# EAGLE design FT232RL (EAGLE 6.4)
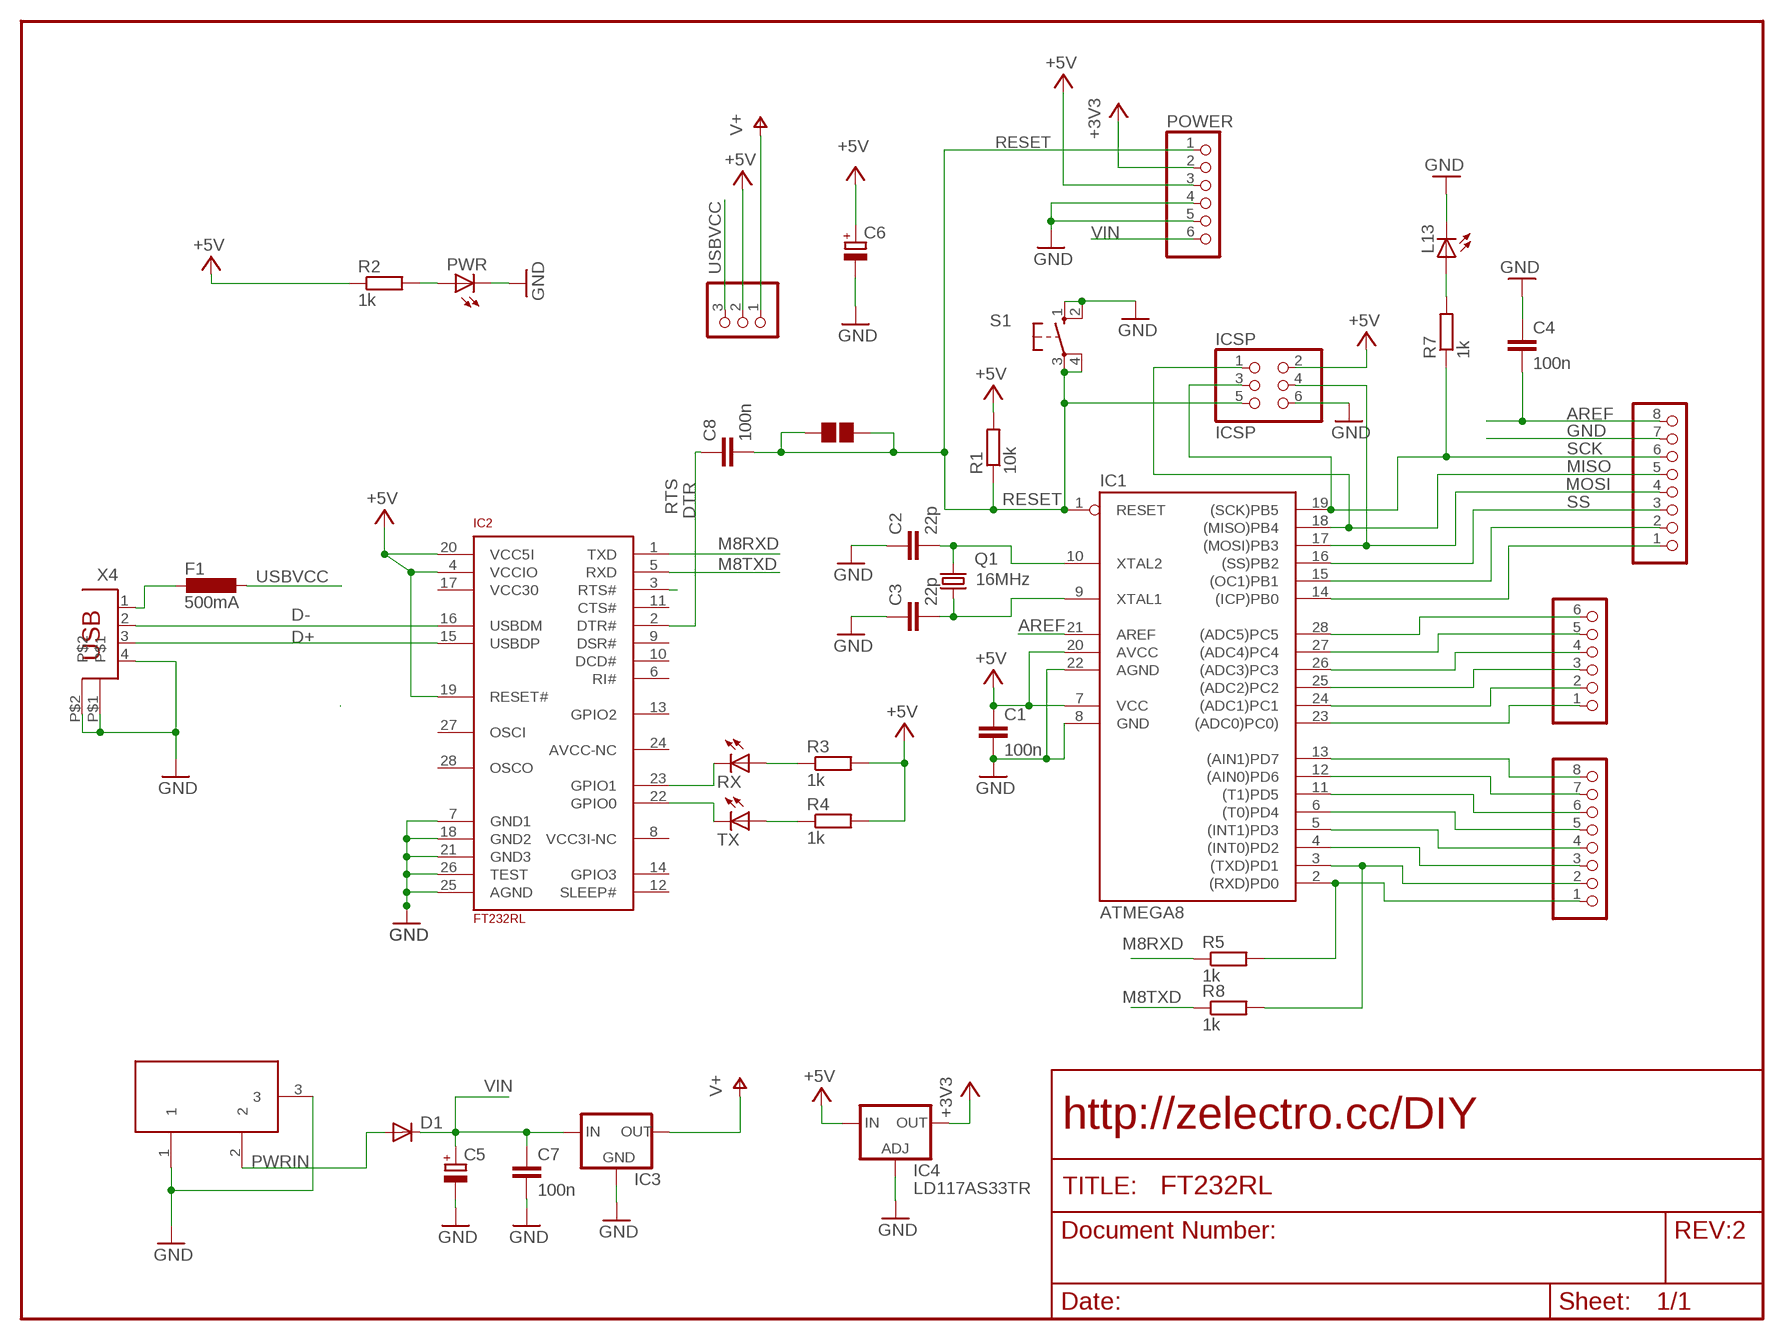
[diagram p0: schematic, sheet 1]

## Parts
C1  100n  C-EUC1206K  [C1206K]
C2  22p  C-EUC1206K  [C1206K]
C3  22p  C-EUC1206K  [C1206K]
C4  100n  C-EUC1206K  [C1206K]
C5  CPOL-EUE2.5-7  [E2,5-7]
C6  CPOL-EUE2.5-7  [E2,5-7]
C7  100n  C-EUC1206K  [C1206K]
C8  100n  C-EUC1206K  [C1206K]
D1  DIODE-SMB  [SMB]
F1  500mA  L-EUL1812  [L1812]
IC1  ATMEGA8  AT90S4433P  [DIL28-3]
IC2  FT232RL  [SSOP28]
IC3  78XXL  [78XXL]
IC4  LD117AS33TR  [SOT223]
ICSP  ICSP  PINHD-2X3  [2X03]
J1  PINHD-1X8  [1X08]
J2  PINHD-1X6  [1X06]
J3  PINHD-1X8  [1X08]
JP3  PINHD-1X3  [1X03]
L13  LED3MM  [LED3MM]
POWER  PINHD-1X6  [1X06]
PWR  LED3MM  [LED3MM]
Q1  16MHz  CRYTALHC49S  [HC49/S]
R1  10k  R-EU_M1406  [M1406]
R2  1k  R-EU_M1406  [M1406]
R3  1k  R-EU_M1406  [M1406]
R4  1k  R-EU_M1406  [M1406]
R5  1k  R-EU_M1406  [M1406]
R7  1k  R-EU_M1406  [M1406]
R8  1k  R-EU_M1406  [M1406]
RX  LED3MM  [LED3MM]
S1  10-XX  [B3F-10XX]
TX  LED3MM  [LED3MM]
X2  DC21MMX  [DC-21MM]
X4  PN61729  [PN61729]

## Nets
+3V3: IC4.4(OUT) POWER.2
+5V [usbvcc]: C1.1 C6.+ IC1.7(VCC) IC1.20(AVCC) IC2.4(VCCIO) IC2.19(RESET#) IC2.20(VCC5I) IC4.3(IN) ICSP.2 JP3.2 POWER.3 R1.2 R2.1 R3.2 R4.2
AREF [aref]: C4.2 IC1.21(AREF) J3.8
D+: IC2.15(USBDP) X4.3
D-: IC2.16(USBDM) X4.2
DTR: C8.1 IC2.2(DTR#)
GND [gnd]: C1.2 C2.1 C3.1 C4.1 C5.- C6.- C7.2 IC1.8(GND) IC1.22(AGND) IC2.7(GND1) IC2.18(GND2) IC2.21(GND3) IC2.25(AGND) IC2.26(TEST) IC3.GND IC4.1(ADJ) ICSP.6 J3.7 L13.K(C) POWER.4 POWER.5 PWR.K(C) S1.1(S) S1.2(S1) X2.1 X2.3 X4.4 X4.P$1 X4.P$2
M8RXD: IC2.1(TXD) R5.1
M8TXD: IC2.5(RXD) R8.1
MISO: IC1.18((MISO)PB4) ICSP.1 J3.5
MOSI: IC1.17((MOSI)PB3) ICSP.4 J3.4
N$2: L13.A R7.2
N$3: PWR.A R2.2
N$5: IC1.14((ICP)PB0) J3.1
N$6: C3.2 IC1.9(XTAL1) Q1.1
N$7: C2.2 IC1.10(XTAL2) Q1.2
N$8 [usbvcc]: F1.2 X4.1
N$10: IC1.4((INT0)PD2) J1.3
N$11: IC1.5((INT1)PD3) J1.4
N$12: IC1.6((T0)PD4) J1.5
N$13: IC1.11((T1)PD5) J1.6
N$14: IC1.12((AIN0)PD6) J1.7
N$15: IC1.13((AIN1)PD7) J1.8
N$16: IC1.23((ADC0)PC0)) J2.1
N$17: IC1.24((ADC1)PC1) J2.2
N$18: IC1.25((ADC2)PC2) J2.3
N$19: IC1.26((ADC3)PC3) J2.4
N$20: IC1.27((ADC4)PC4) J2.5
N$21: IC1.28((ADC5)PC5) J2.6
N$22: IC1.15((OC1)PB1) J3.2
N$32: IC2.23(GPIO1) RX.K(C)
N$34: IC2.22(GPIO0) TX.K(C)
N$35: R3.1 RX.A
N$36: R4.1 TX.A
PD0: IC1.2((RXD)PD0) J1.1 R5.2
PD1: IC1.3((TXD)PD1) J1.2 R8.2
PWRIN [power]: D1.A X2.2
RESET: C8.2 IC1.1(RESET) ICSP.5 POWER.1 R1.1 S1.3(P) S1.4(P1)
RTS: IC2.3(RTS#)
SCK: IC1.19((SCK)PB5) ICSP.3 J3.6 R7.1
SS: IC1.16((SS)PB2) J3.3
USBVCC [usbvcc]: F1.1 JP3.3
V+ [usbvcc]: IC3.OUT JP3.1
VIN [power]: C5.+ C7.1 D1.C IC3.IN POWER.6
Unconnected: IC2.6(RI#) IC2.8(VCC3I-NC) IC2.9(DSR#) IC2.10(DCD#) IC2.11(CTS#) IC2.12(SLEEP#) IC2.13(GPIO2) IC2.14(GPIO3) IC2.24(AVCC-NC) IC2.27(OSCI) IC2.28(OSCO)

## Notes on the sheet
- http://zelectro.cc/DIY
- 2

## Power pins joined to a net without a drawn wire
VCC30: IC2.17(VCC30)

## Library data of the parts
C1-C4 C7 C8 = rcl:C-EU: CAPACITOR, European symbol
C5 C6 = rcl:CPOL-EU: POLARIZED CAPACITOR, European symbol
D1 = diode:DIODE-: DIODE
F1 = rcl:L-EU: INDUCTOR, European symbol
IC1 = atmel:AT90S4433: MICROCONTROLLER 4 Kbytes FLASH 128 bytes SRAM 256 bytes EEPROM UART 6-channel 10 bit ADC
IC2 = SmartPrj:FT232RL
IC3 = v-reg:78XXL: VOLTAGE REGULATOR
IC4 = v-reg:LD117A?*: Low drop fixed and adjustable positive voltage regulators 1 A Source: http://www.st.com/stonline/products/literature/ds/7194/ld1117axx.pdf
ICSP = pinhead:PINHD-2X3: PIN HEADER
J1 J3 = pinhead:PINHD-1X8: PIN HEADER
J2 POWER = pinhead:PINHD-1X6: PIN HEADER
JP3 = pinhead:PINHD-1X3: PIN HEADER
L13 PWR RX TX = led:LED: LED OSRAM: - CHIPLED LG R971, LG N971, LY N971, LG Q971, LY Q971, LO R971, LY R971 LH N974, LH R974 LS Q976, LO Q976, LY Q976 LO Q996 - Hyper CHIPLED LW Q18S LB Q993, LB Q99A, LB R99A - SideLED LS A670, LO A670, LY A670, LG A670, LP A670 LB A673, LV A673, LT A673, LW A673 LH A674 LY A675 LS A676, LA A676, LO A676, LY A676, LW A676 LS A679, LY A679, LG A679 - Hyper Micro SIDELED® LS Y876, LA Y876, LO Y876, LY Y876 LT Y87S - SmartLED LW L88C, LW L88S LB L89C, LB L89S, LG L890 LS L89K, LO L89K, LY L89K LS L896, LA L896, LO L896, LY L896 - TOPLED LS T670, LO T670, LY T670, LG T670, LP T670 LSG T670, LSP T670, LSY T670, LOP T670, LYG T670 LG T671, LOG T671, LSG T671 LB T673, LV T673, LT T673, LW T673 LH T674 LS T676, LA T676, LO T676, LY T676, LB T676, LH T676, LSB T676, LW T676 LB T67C, LV T67C, LT T67C, LS T67K, LO T67K, LY T67K, LW E67C LS E67B, LA E67B, LO E67B, LY E67B, LB E67C, LV E67C, LT E67C LW T67C LS T679, LY T679, LG T679 LS T770, LO T770, LY T770, LG T770, LP T770 LB T773, LV T773, LT T773, LW T773 LH T774 LS E675, LA E675, LY E675, LS T675 LS T776, LA T776, LO T776, LY T776, LB T776 LHGB T686 LT T68C, LB T68C - Hyper Mini TOPLED® LB M676 - Mini TOPLED Santana® LG M470 LS M47K, LO M47K, LY M47K Source: http://www.osram.convergy.de LUXEON: - LUMILED® LXK2-PW12-R00, LXK2-PW12-S00, LXK2-PW14-U00, LXK2-PW14-V00 LXK2-PM12-R00, LXK2-PM12-S00, LXK2-PM14-U00 LXK2-PE12-Q00, LXK2-PE12-R00, LXK2-PE12-S00, LXK2-PE14-T00, LXK2-PE14-U00 LXK2-PB12-K00, LXK2-PB12-L00, LXK2-PB12-M00, LXK2-PB14-N00, LXK2-PB14-P00, LXK2-PB14-Q00 LXK2-PR12-L00, LXK2-PR12-M00, LXK2-PR14-Q00, LXK2-PR14-R00 LXK2-PD12-Q00, LXK2-PD12-R00, LXK2-PD12-S00 LXK2-PH12-R00, LXK2-PH12-S00 LXK2-PL12-P00, LXK2-PL12-Q00, LXK2-PL12-R00 Source: www.luxeon.com KINGBRIGHT: KA-3528ASYC Source: www.kingbright.com
Q1 = crystal:CRYTAL: CRYSTAL
R1-R5 R7 R8 = rcl:R-EU_: RESISTOR, European symbol
S1 = switch-omron:10-XX: OMRON SWITCH
X2 = powersupply:DC21MM
X4 = SmartPrj:PN61729: BERG USB connector

## Net classes
1 power: width 0.61 mm, drill 0.508 mm, clearance 0.152 mm
2 gnd: width 0.305 mm, drill 0.508 mm, clearance 0.152 mm
3 usbvcc: width 0.508 mm, drill 0.508 mm, clearance 0.152 mm
4 aref: width 0.406 mm

## Board
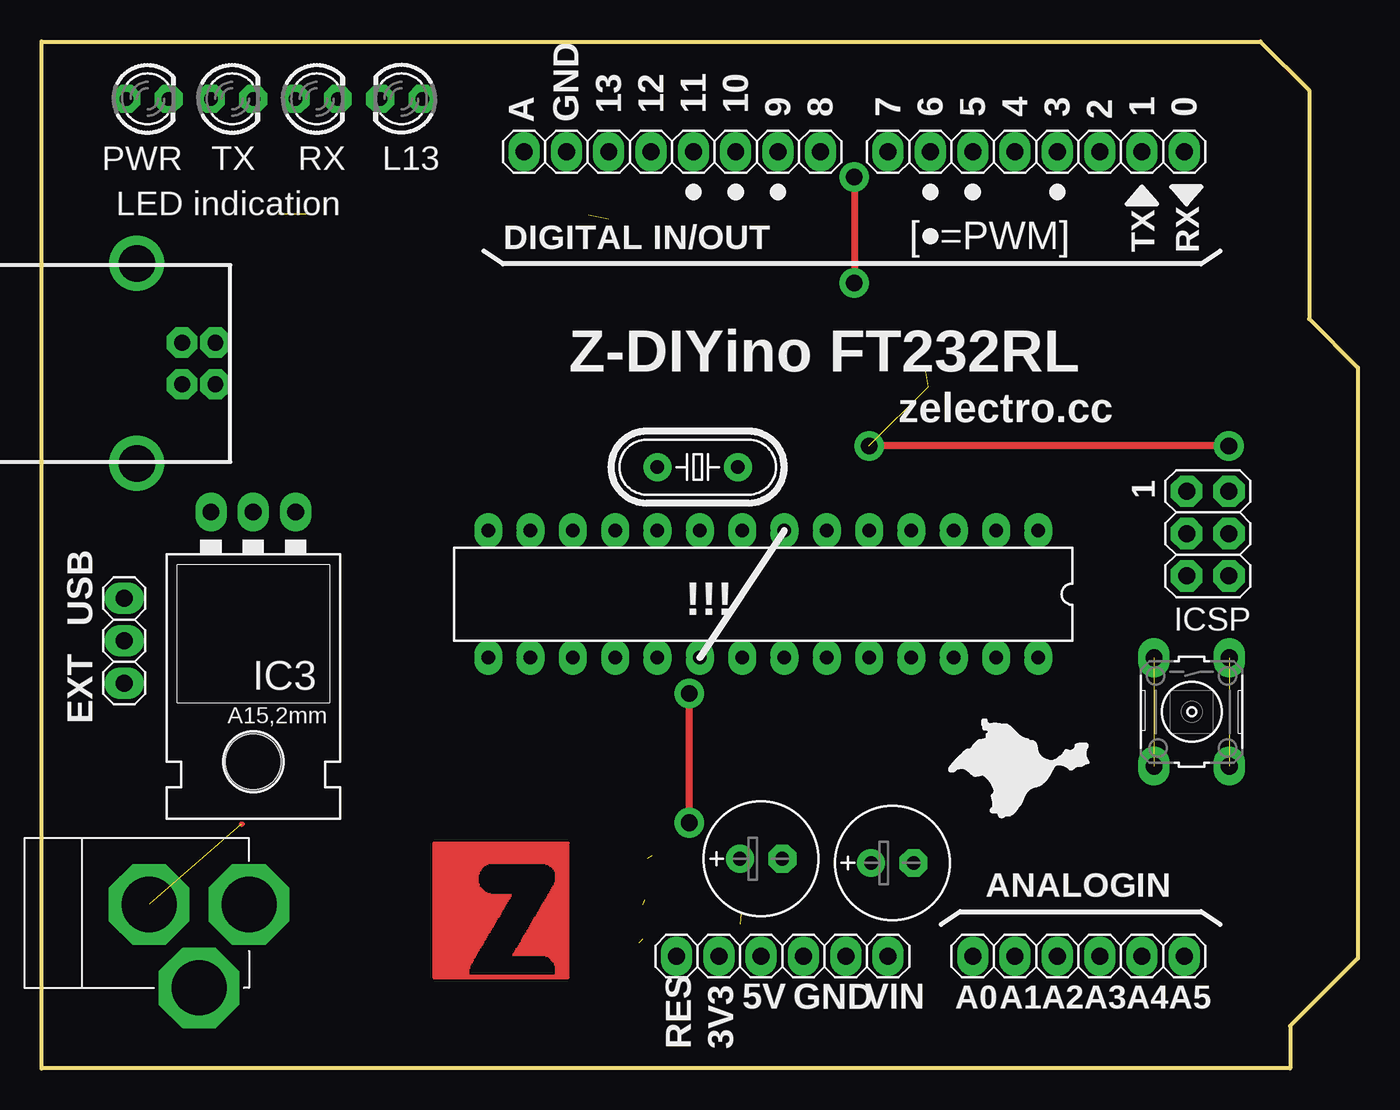
[diagram p1: board, top side]
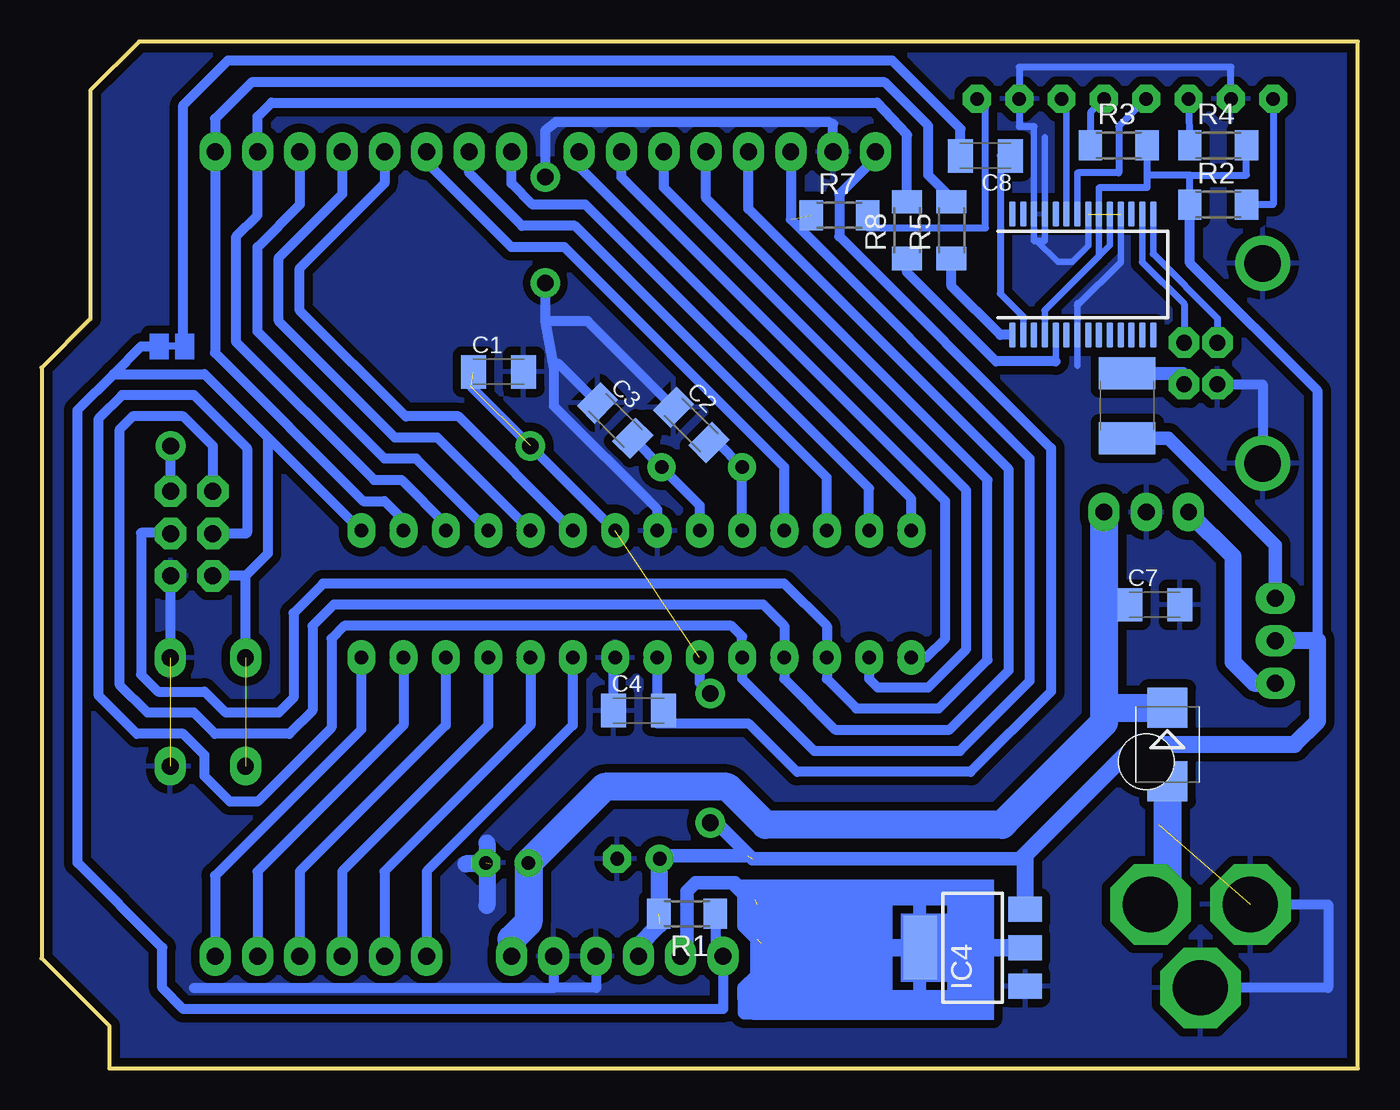
[diagram p2: board, bottom side, seen from below]

Size 78.99 x 61.59 mm. Coordinates in mm from the lower left corner, seen from the top.
Outline: 0,61.59 73.15,61.59 76.07,58.67 76.07,44.96 78.99,42.04 78.99,6.6 74.93,2.54 74.93,0 0,0 0,61.59
Copper layers (1*16): Top 0.035mm / dielectric 1.5mm / Bottom 0.035mm
Design rules "default": minimum track width 10mil, minimum drill 24mil, track to track 8mil, track to pad 8mil, pad to pad 8mil, via to via 8mil, smd to smd 8mil, copper to edge 20mil, drill to drill 8mil, minimum pad ring 17mil, minimum via ring 8mil, stop-mask expansion 0mil, vias tented up to drill 0mil, thermal gap 20mil

### Footprints (pad centres in the part's own frame; a part is rotated, then mirrored left to right if it is on the bottom)
C1206K = smd 1.5 x 2: 1 -1.5,0; 2 1.5,0
E2,5-7 = drill 0.813 pad 1.6: + -1.27,0 | drill 0.813 pad 1.6 octagon: - 1.27,0
SMB = smd 2.4 x 2.4: A 2.2,0; C -2.2,0
L1812 = smd 1.9 x 3.4: 1 -1.95,0; 2 1.95,0
DIL28-3 = drill 0.813 long: 1 -16.51,-3.81; 2 -13.97,-3.81; 3 -11.43,-3.81; 4 -8.89,-3.81; 5 -6.35,-3.81; 6 -3.81,-3.81; 7 -1.27,-3.81; 8 1.27,-3.81; 9 3.81,-3.81; 10 6.35,-3.81; 11 8.89,-3.81; 12 11.43,-3.81; 13 13.97,-3.81; 14 16.51,-3.81; 15 16.51,3.81; 16 13.97,3.81; 17 11.43,3.81; 18 8.89,3.81; 19 6.35,3.81; 20 3.81,3.81; 21 1.27,3.81; 22 -1.27,3.81; 23 -3.81,3.81; 24 -6.35,3.81; 25 -8.89,3.81; 26 -11.43,3.81; 27 -13.97,3.81; 28 -16.51,3.81
SSOP28 = smd 0.381 x 1.499: 1 -4.225,-3.625; 2 -3.575,-3.625; 3 -2.925,-3.625; 4 -2.275,-3.625; 5 -1.625,-3.625; 6 -0.975,-3.625; 7 -0.325,-3.625; 8 0.325,-3.625; 9 0.975,-3.625; 10 1.625,-3.625; 11 2.275,-3.625; 12 2.925,-3.625; 13 3.575,-3.625; 14 4.225,-3.625; 15 4.225,3.625; 16 3.575,3.625; 17 2.925,3.625; 18 2.275,3.625; 19 1.625,3.625; 20 0.975,3.625; 21 0.325,3.625; 22 -0.325,3.625; 23 -0.975,3.625; 24 -1.625,3.625; 25 -2.275,3.625; 26 -2.925,3.625; 27 -3.575,3.625; 28 -4.225,3.625
78XXL = drill 1.016 long: GND 0,-3.81; IN -2.54,-3.81; OUT 2.54,-3.81 | hole 3.302: 0,11.176
SOT223 = smd 1.5 x 2: 1 -2.3,-3.15; 2 0,-3.15; 3 2.3,-3.15 | smd 3.8 x 2: 4 0,3.15
2X03 = drill 1.016 octagon: 1 -2.54,-1.27; 2 -2.54,1.27; 3 0,-1.27; 4 0,1.27; 5 2.54,-1.27; 6 2.54,1.27
1X08 = drill 1.016 long: 1 -8.89,0; 2 -6.35,0; 3 -3.81,0; 4 -1.27,0; 5 1.27,0; 6 3.81,0; 7 6.35,0; 8 8.89,0
1X06 = drill 1.016 long: 1 -6.35,0; 2 -3.81,0; 3 -1.27,0; 4 1.27,0; 5 3.81,0; 6 6.35,0
1X03 = drill 1.016 long: 1 -2.54,0; 2 0,0; 3 2.54,0
LED3MM = drill 0.813 octagon: A -1.27,0; K 1.27,0
HC49/S = drill 0.813: 1 -2.413,0; 2 2.413,0
M1406 = smd 1.4 x 1.8: 1 -1.7,0; 2 1.7,0
B3F-10XX = drill 1.016 long: 1 -3.251,2.261; 2 3.251,2.261; 3 -3.251,-2.261; 4 3.251,-2.261
DC-21MM = drill 3.302 pad 4.826 octagon: 1 -5.08,-3.353; 2 -0.076,-6.35; 3 -0.076,-0.356
PN61729 = drill 0.95 octagon: 1 1.25,4.71; 2 -1.25,4.71; 3 -1.25,2.71; 4 1.25,2.71 | drill 2.2: P$1 -6,0; P$2 6,0

### Placement (x,y rotation side)
C1  51.56,41.78 0 bottom
C2  40,38.61 315 bottom
C3  44.58,38.86 315 bottom
C4  43.18,21.46 0 bottom
C5  51.05,12.32 0 top
C6  43.18,12.57 0 top
C7  12.19,27.81 0 bottom
C8  22.35,54.74 180 bottom
D1  11.43,19.43 270 bottom
F1  13.84,39.75 90 bottom
IC1  43.31,28.45 180 top
IC2  16.51,47.62 0 bottom
IC3  12.7,29.57 180 top
IC4  23.11,7.24 90 bottom
ICSP  69.99,32.08 270 top
J1  59.69,54.99 180 top
J2  62.23,6.73 0 top
J3  37.85,54.99 180 top
JP3  4.95,25.65 90 top
L13  21.59,58.17 180 top
POWER  44.45,6.73 0 top
PWR  6.35,58.17 0 top
Q1  39.37,36.07 180 top
R1  40.26,9.27 180 bottom
R2  8.38,51.82 0 bottom
R3  14.35,55.37 0 bottom
R4  8.38,55.37 0 bottom
R5  24.38,50.29 90 bottom
R7  31.11,51.18 0 bottom
R8  27.05,50.29 90 bottom
RX  16.51,58.17 0 top
S1  69.02,21.39 270 top
TX  11.43,58.17 0 top
X2  6.1,9.91 90 top
X4  5.71,42.29 270 top

### Tracks (layer width: path | path; a pad name or v marks a point on that pad's centre or on a via)
+3V3  (2 unrouted)
  Bottom 0.61: POWER.2 40.26,7.11 | 36.2,10.11 32.13,7.11 IC4.4 19.66,7.24
  Bottom 0.813: 40.26,7.11 40.26,10.62 39.75,11.12 37.39,11.12 | 37.54,11.12 37.46,11.05 | 37.46,11.05 36.83,10.41 36.83,8.51 36.07,7.75 36.07,5.59 36.83,4.83 36.8,3.33 36.17,3.33 36.2,4.83 | 35.81,7.49 35.81,8.38 36.45,9.02 36.45,10.67 | 37.46,11.05 37.39,11.12 | 37.39,11.12 36.07,9.8 36.07,8.76
+5V  (via drill 1 pad 1.78)  (5 unrouted)
  Top 0.406: v38.86,22.48 v38.86,14.73 | v71.25,37.34 v49.66,37.34
  Bottom 0.381: IC2.19 14.88,49.38 15.54,48.73 IC2.20 15.54,52.83 15.49,52.83 | 18.79,45.48 IC2.4
  Bottom 0.406: R3.2 12.65,53.59 | 10.08,53.59 6.68,53.59 R4.2 | 12.65,53.59 12.65,52.83 15.49,52.83 | 15.54,48.73 18.79,45.48 | R2.1 10.08,53.59 | 10.08,53.59 12.65,53.59
  Bottom 0.61: ICSP.2 71.26,37.08 v71.25,37.34 | 19.96,12.57 20.19,12.57 | 2.41,25.65 2.41,40.64 10.08,48.31 R2.1 | IC1.20 39.5,23.11 v38.86,22.48 | POWER.3 43.18,7.37 | 53.21,40.89 IC1.7
  Bottom 0.813: 20.19,12.57 36.32,12.57 38.48,14.73 v38.86,14.73 | C6.+ 41.72,12.76 36.64,12.76
  Bottom 1.016: IC4.3 19.96,12.57 | 20.19,12.57 13.34,19.43 3.81,19.43 2.41,20.83 2.41,25.65 JP3.2 | 43.18,7.37 41.91,8.64 C6.+
AREF
  Bottom 0.61: J3.8 28.96,54.61 31.11,52.45 31.11,49.91 18.41,37.21 18.41,22.61 23.24,17.78 33.66,17.78 36.58,20.7 42.04,20.7 42.04,21.72 | C4.2 42.04,21.72 | 42.04,21.72 IC1.21
D+
  Bottom 0.381: IC2.15 12.29,48.86
  Bottom 0.406: 12.29,48.86 8.43,45 X4.3
D-
  Bottom 0.381: IC2.16 12.94,48.37
  Bottom 0.406: 12.94,48.37 10.43,45.86 X4.2
DTR
  Bottom 0.381: 20.08,45.1 IC2.2
  Bottom 0.406: C8.1 21.46,54.76 21.46,46.48 20.08,45.1
GND  (via drill 1 pad 1.78)  (4 unrouted)
  Top 0.305: 11.99,14.66 12.04,14.66
  Top 0.406: v48.77,53.47 v48.77,47.12
  Bottom 0.381: IC2.21 16.18,49.35 17.14,48.39 18.01,48.39 19.28,49.66 | 18.79,49.66 IC2.25 | 19.43,49.66 IC2.26 19.43,56.51 | IC2.18 14.24,48.38 | 16.84,45.78 IC2.7 | 16.83,45.9 16.83,42.16 | 18.79,55.85 18.79,50.59
  Bottom 0.406: 19.43,49.66 19.28,49.66 18.79,49.66 | 19.43,56.51 20.32,56.51 L13.K 20.32,60.07 7.62,60.07 PWR.K | 14.24,48.38 16.84,45.78
  Bottom 0.61: S1.1 71.26,25.25 ICSP.6 | J3.7 31.5,56.64 31.75,56.77 48.13,56.77 48.77,56.26 v48.77,53.47 | v48.77,47.12 48.77,44.83 | 48.77,44.83 48.26,42.04 | 48.26,42.04 48.26,39.75 42.04,33.53 IC1.8 | C2.1 46.23,44.83 48.77,44.83 | C3.1 48.01,42.29 48.26,42.04 | POWER.4 45.72,4.83 48.26,4.83 | POWER.5 48.26,4.83 | 69.85,4.83 48.26,4.83 | X4.P$2 5.71,41.04 X4.4 | X2.3 1.78,9.83 1.78,4.83 X2.1 | C4.1 44.68,24.41 44.58,24.51 IC1.22
  Bottom 1.016: 52.26,13.51 52.26,9.77 | 52.02,12.26 53.55,12.26
  pour Bottom (isolate 0.508, rank 3): 0.64,60.96 72.77,60.96 79.38,59.18 79.88,0.13 0.76,-0.13 0.64,5.08
M8RXD
  Bottom 0.381: IC2.1 20.86,44
  Bottom 0.61: R5.1 24.38,46.92 21.46,44 20.86,44
M8TXD
  Bottom 0.381: IC2.5 18.13,42.42
  Bottom 0.61: 18.13,42.42 21.72,42.42 27.05,47.75 R8.1
MISO
  Bottom 0.61: J3.5 36.58,51.56 20.95,35.94 20.95,23.88 24.51,20.32 31.37,20.32 34.42,23.37 IC1.18 34.42,26.54 35.69,27.81 61.47,27.81 62.74,26.54 62.74,21.46 64.14,20.07 68.58,20.07 69.85,21.34 72.64,21.34 74.3,22.99 74.3,38.35 73.53,39.12 70.48,39.12 68.72,37.35 ICSP.1
MOSI
  Bottom 0.61: ICSP.4 71.31,32.13 73.03,32.13 73.03,23.62 72.01,22.61 69.22,22.61 67.95,21.34 64.77,21.34 63.88,22.23 63.88,27.3 62.1,29.08 34.42,29.08 31.88,26.54 IC1.17 31.88,23.37 30.1,21.59 25.15,21.59 22.22,24.51 22.22,35.31 39.12,52.2 J3.4
N$2
  Bottom 0.406: R7.2 29.41,50.42 22.35,50.42 22.35,57.66 L13.A
N$3
  Bottom 0.406: PWR.A 5.08,51.82 R2.2
N$4
  Top 0.178: 23.53,5.45 31.6,5.45 31.6,13.51 23.53,13.51 23.53,5.45
N$5
  Bottom 0.61: IC1.14 26.8,34.16 46.74,54.1 J3.1
N$6
  Bottom 0.61: Q1.1 39.5,33.78 IC1.9 | C3.2 Q1.1 | Q1.1
N$7
  Bottom 0.61: IC1.10 Q1.2 38.44,37.55 C2.2
N$8
  Bottom 0.813: X4.1 10.52,41.68 F1.2
N$10
  Bottom 0.61: IC1.4 56.52,36.58 58.42,36.58 66.04,44.2 66.04,49.28 63.5,51.82 J1.3
N$11
  Bottom 0.61: IC1.5 55.24,37.85 57.78,37.85 64.77,44.83 64.77,48.64 60.96,52.45 J1.4
N$12
  Bottom 0.61: IC1.6 53.98,39.12 57.15,39.12 63.5,45.47 63.5,48.01 58.42,53.09 J1.5
N$13
  Bottom 0.61: IC1.11 34.42,36.07 47.62,49.28 50.8,49.28 55.88,54.36 J1.6
N$14
  Bottom 0.61: IC1.12 31.88,35.43 46.99,50.55 50.16,50.55 53.34,53.72 J1.7
N$15
  Bottom 0.61: IC1.13 29.34,34.8 46.35,51.82 49.53,51.82 50.8,53.09 J1.8
N$16
  Bottom 0.61: IC1.23 47.12,20.57 55.88,11.81 J2.1
N$17
  Bottom 0.61: IC1.24 49.66,20.57 58.42,11.81 J2.2
N$18
  Bottom 0.61: IC1.25 52.2,20.57 60.96,11.81 J2.3
N$19
  Bottom 0.61: IC1.26 54.74,20.57 63.5,11.81 J2.4
N$20
  Bottom 0.61: IC1.27 57.28,20.57 66.04,11.81 J2.5
N$21
  Bottom 0.61: IC1.28 59.82,20.32 68.58,11.56 J2.6
N$22
  Bottom 0.61: J3.2 44.2,53.47 24.76,34.04 24.76,25.78 25.91,24.64 IC1.15
N$32
  Bottom 0.381: 17.48,58.17 IC2.23
  Bottom 0.406: RX.K 17.48,58.17
N$34
  Bottom 0.381: IC2.22 16.84,53.72 16.76,53.72
  Bottom 0.406: TX.K 14.35,56.51 14.35,53.72 16.76,53.72
N$35
  Bottom 0.406: RX.A 16.05,57.35 R3.1
N$36
  Bottom 0.406: TX.A 10.16,57.91 R4.1
PD0
  Bottom 0.61: IC1.2 57.28,32.89 58.42,34.04 59.69,34.04 68.58,42.93 J1.1 68.58,56.97 66.4,59.16 28.4,59.16 25.78,56.54 25.78,53.59 24.51,52.32 R5.2
PD1
  Bottom 0.61: IC1.3 54.74,32.64 57.4,35.31 59.05,35.31 67.31,43.56 67.31,49.91 66.04,51.18 J1.2 66.04,57.1 65.2,57.94 28.85,57.94 27.05,56.01 R8.2
PWRIN
  Bottom 1.676: D1.A 11.43,10.85 X2.2
RESET  (1 unrouted)
  Bottom 0.406: 70.48,43.31 72.01,43.31
  Bottom 0.61: 74.68,41.66 69.22,41.66 65.41,37.85 | 65.41,37.85 IC1.1 | S1.3 66.76,29.54 | 66.76,29.54 ICSP.5 | 66.76,29.54 65.41,30.9 65.41,37.85 | C8.2 23.85,56.36 27.94,60.45 67.82,60.45 70.48,57.78 70.48,43.31 | R1.1 38.56,7.19 POWER.1 38.1,3.56 70.48,3.56 71.76,4.83 71.76,7.24 76.84,12.32 76.84,39.5 74.68,41.66 | 74.68,41.66 73.03,43.31 72.01,43.31 71.88,43.31
SCK  (1 unrouted)
  Bottom 0.61: ICSP.3 66.73,32.08 66.68,32.13 66.68,37.21 69.85,40.39 74.17,40.39 75.57,38.99 75.57,22.35 73.28,20.07 70.48,20.07 69.22,18.8 69.22,17.53 67.69,16 66.04,16 61.59,20.45 61.59,25.78 60.83,26.54 37.59,26.54 36.96,25.91 IC1.19 36.96,23.37 32.64,19.05 23.88,19.05 19.68,23.24 19.68,36.58 34.04,50.93 J3.6
SS
  Bottom 0.61: J3.3 41.66,52.83 23.49,34.67 23.49,25.15 25.78,22.86 28.83,22.86 29.34,23.37 IC1.16
USBVCC
  Bottom 0.813: F1.1 11.38,37.8 4.95,31.37 JP3.3
V+
  Bottom 1.016: JP3.1 6.22,23.11 7.49,24.38 7.49,30.71 IC3.OUT
VIN
  Bottom 0.61: C7.1 15.24,27.81
  Bottom 1.676: IC3.IN 15.24,27.81 15.24,21.63 | 15.24,21.63 D1.C | 15.24,21.63 15.24,20.74 20.95,15.03 21.34,14.61 35.56,14.61 37.85,16.89 45.21,16.89 C5.+ 49.78,8.76 50.8,7.75 POWER.6
(copper drawn outside any net)
  shapes: Bottom area x17, Bottom circle x3, Top area x231

### Text on the board
tPlace: 13 | 12 | 11 | 10 | 9 | 8 | 7 | 6 | 5 | 4 | 3 | 2 | 1 | 0 | A | GND | LED indication | [ | =PWM] | DIGITAL IN/OUT | TX | RX | Z-DIYino FT232RL | zelectro.cc | 1 | USB | !!! | EXT | ANALOG | IN | 5V | GND | VIN | A0 | A1 | A2 | A3 | A4 | A5 | RES | 3V3
Reference: C8 | R7 | R5 | R6 | R4 | C3 | C2 | R9 | R8 | R1 | R2 | C1 | C4 | C5 | X2 | C7 | C6